# Altium project FireworkLauncher.PrjPcb
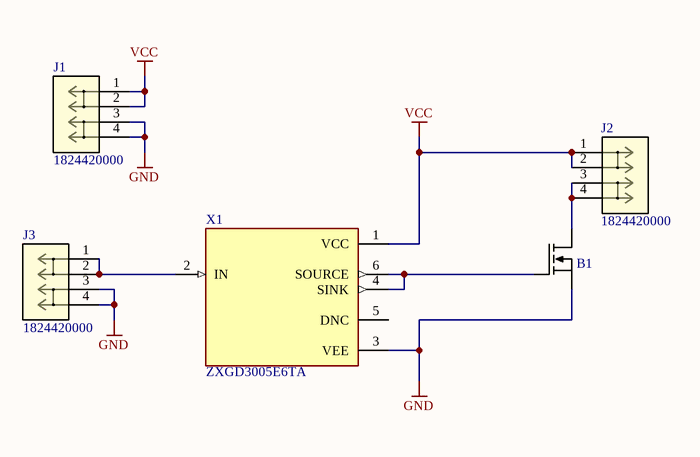
[diagram p0: Schema.SchDoc]
1 sheet, 5 parts. Net scope: global (net labels, ports and power ports of the same name join across sheets).
Board file: PCB.PcbDoc

## Sheet Schema.SchDoc
size A4; SheetNumber: 1; SheetTotal: 1

### Parts
B1  N Kanal FET  [SOT23-3]  (value not drawn)
J1  1824420000  [CONN2_1824420000_WED]
J2  1824420000  [CONN2_1824420000_WED]
J3  1824420000  [CONN2_1824420000_WED]
X1  ZXGD3005E6TA  [SOT26]

### Nets
GND: B1.2(Source) J1.3 J1.4 J3.3 J3.4 X1.3(VEE)
VCC: J1.1 J1.2 J2.1 J2.2 X1.1(VCC)
NetB1_1: B1.1(Gate) X1.4(SINK) X1.6(SOURCE)
NetB1_3: B1.3(Drain) J2.3 J2.4
NetJ3_1: J3.1 J3.2 X1.2(IN)

Not connected (* = marked no-connect by the designer): X1 5(DNC)

### Library data of the parts
J1-J3 = 1824420000: No Description Available; Mfr_Name: Weidmuller; Copyright: Copyright (C) 2021 Ultra Librarian. All rights reserved.; Manufacturer_Part_Number: 1824420000; Digi-Key_Part_Number_1: 281-2020-ND; RefDes: RefDes; Type: DEV
X1 = ZXGD3005E6TA: Low-Side Gate Driver IC Non-Inverting SOT-26; Package: None; Price: None; Value: *; MP: ZXGD3005E6TA; Availability: Unavailable